# EAGLE board New_U540 (EAGLE 9.6.2), part 1 of 2
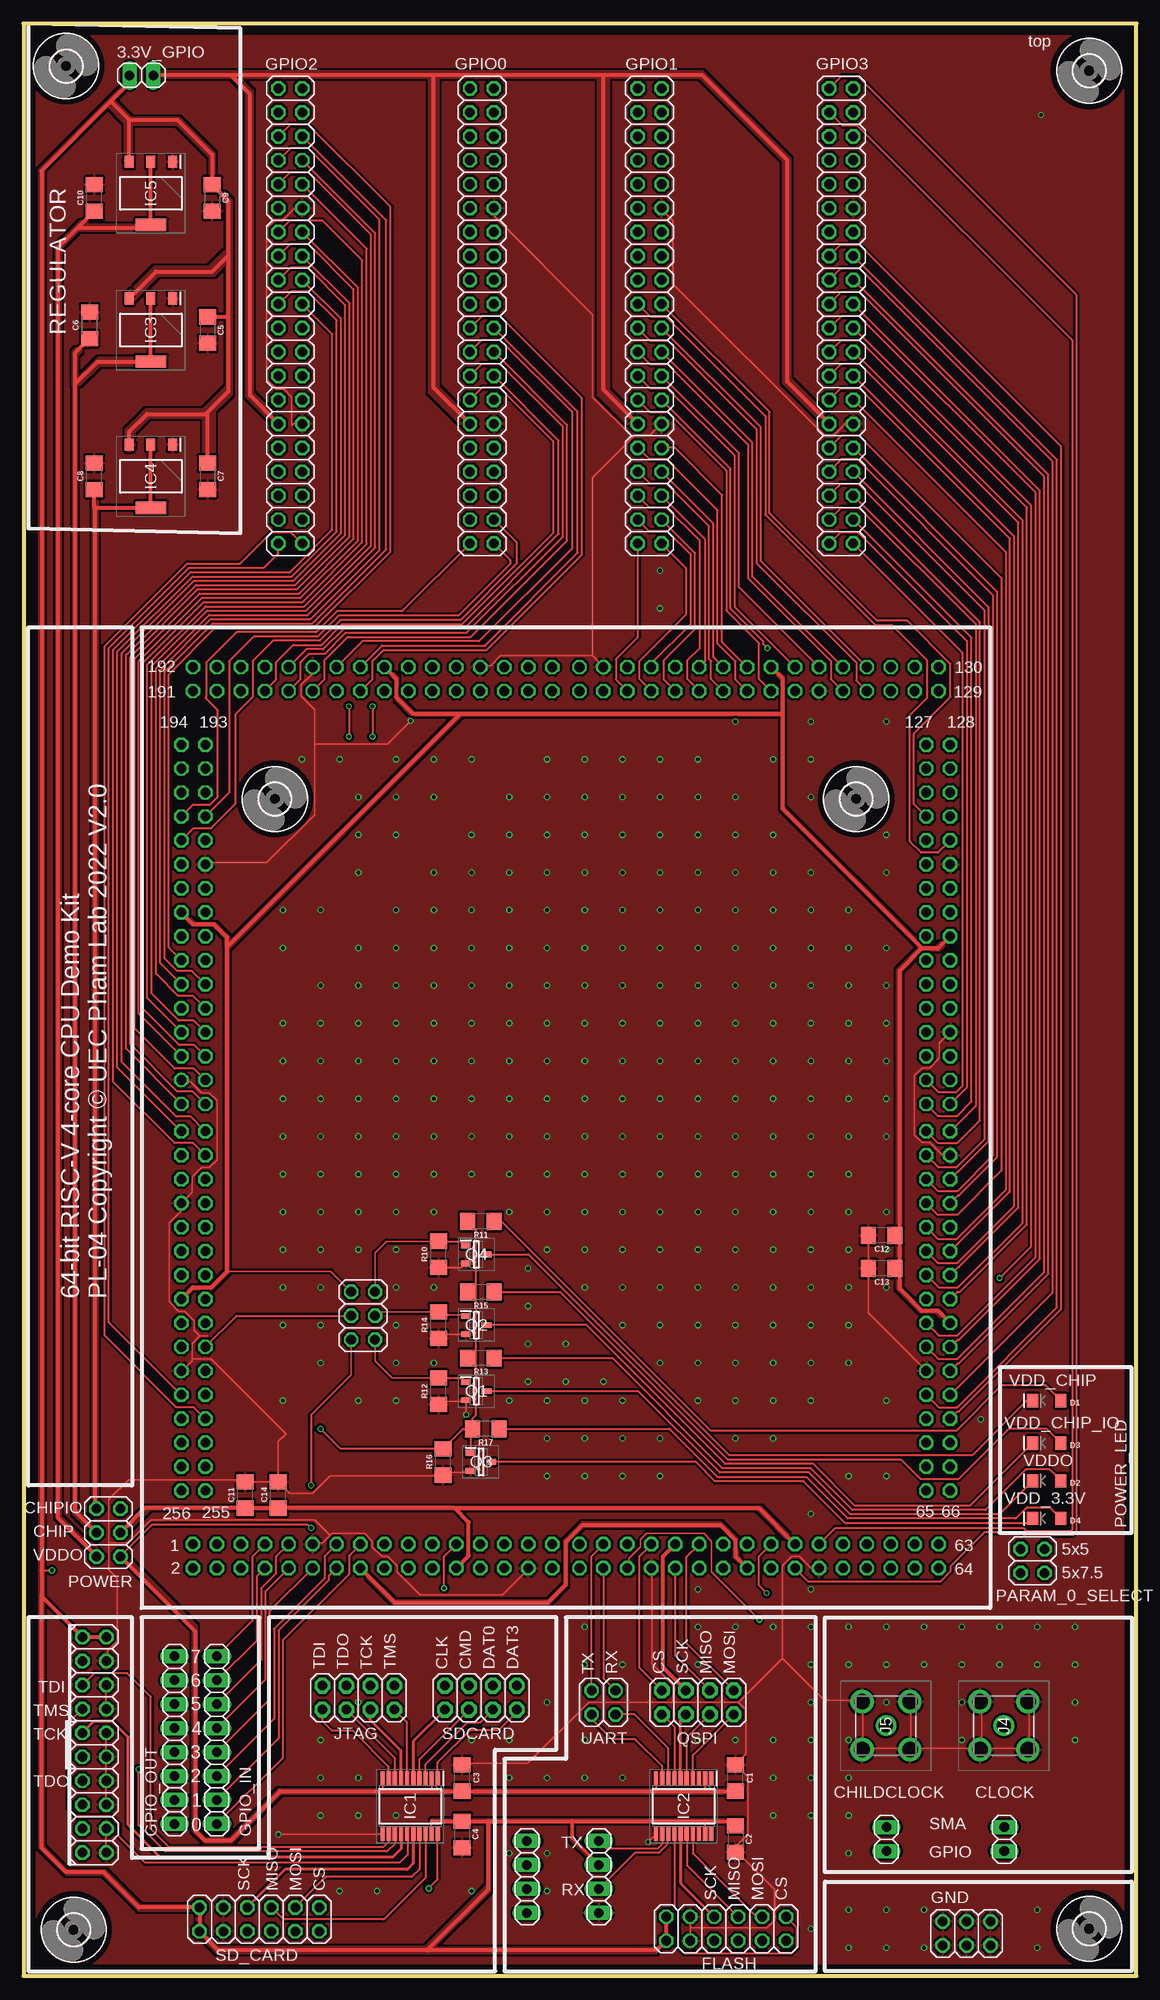
[diagram p5: board, top side]
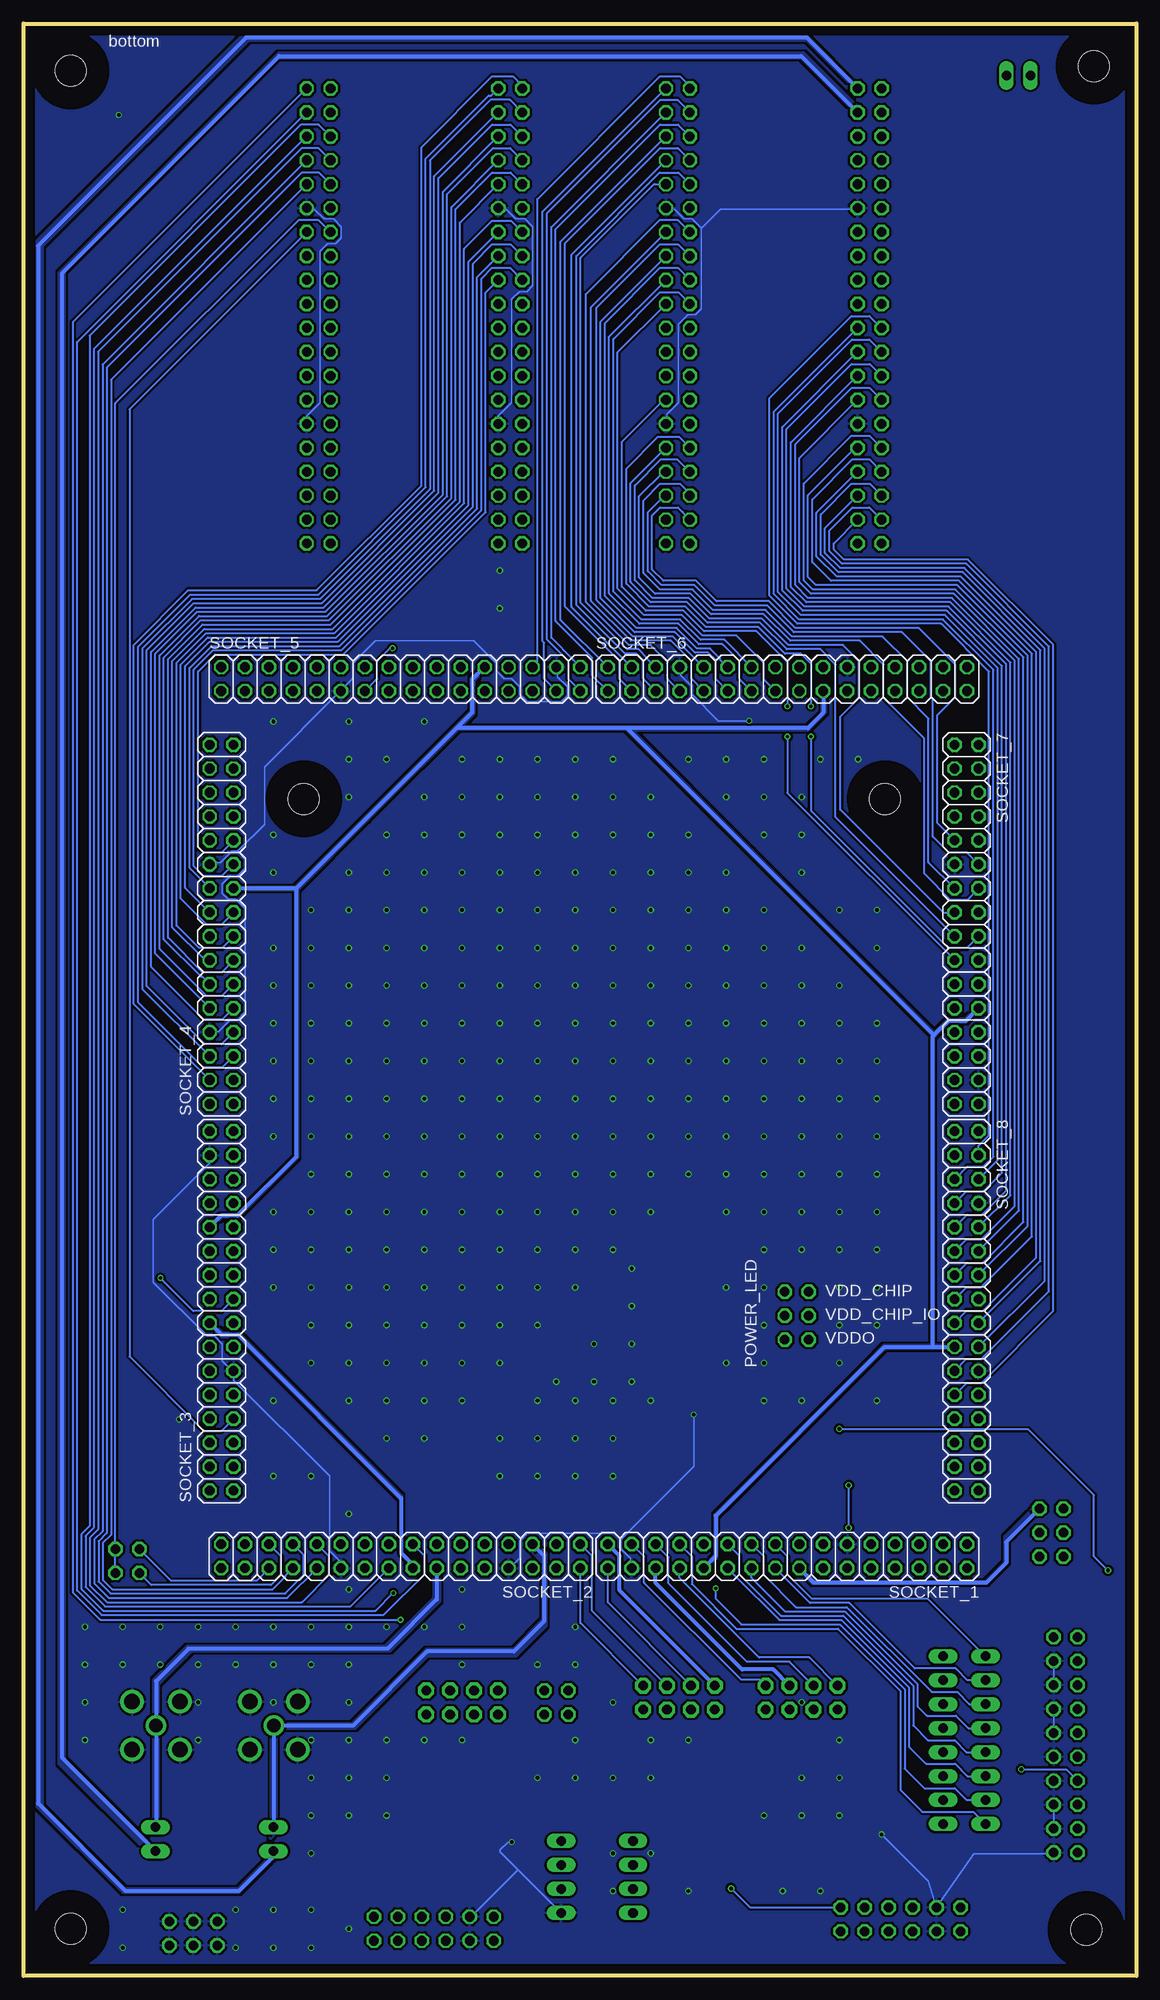
[diagram p6: board, bottom side, seen from below]

Size 118 x 207 mm. Coordinates in mm from the lower left corner, seen from the top.
Outline: 0,0 118,0 118,207 0,207 0,0
Copper layers (1*16): Top 0.035mm / dielectric 1.5mm / Bottom 0.035mm
Design rules "default *": minimum track width 6mil, minimum drill 0.35mm, track to track 10mil, track to pad 10mil, pad to pad 6mil, via to via 10mil, smd to smd 10mil, copper to edge 40mil, drill to drill 6mil, minimum pad ring 0.13mm, minimum via ring 0.13mm, stop-mask expansion 4mil, vias tented up to drill 0mil, thermal gap 10mil

## Footprints (pad centres in the part's own frame; a part is rotated, then mirrored left to right if it is on the bottom)
1X02 = drill 1.016 long: 1 -1.27,0; 2 1.27,0
1206 = smd 1.6 x 1.8: 1 -1.4,0; 2 1.4,0
LED-1206 = smd 1.2 x 1.4: A -1.5,0; C 1.5,0
2X06 = drill 1.016 octagon: 1 -6.35,-1.27; 2 -6.35,1.27; 3 -3.81,-1.27; 4 -3.81,1.27; 5 -1.27,-1.27; 6 -1.27,1.27; 7 1.27,-1.27; 8 1.27,1.27; 9 3.81,-1.27; 10 3.81,1.27; 11 6.35,-1.27; 12 6.35,1.27
2X03 = drill 1.016 octagon: 1 -2.54,-1.27; 2 -2.54,1.27; 3 0,-1.27; 4 0,1.27; 5 2.54,-1.27; 6 2.54,1.27
2X20 = drill 1.016 octagon: 1 -24.13,-1.27; 2 -24.13,1.27; 3 -21.59,-1.27; 4 -21.59,1.27; 5 -19.05,-1.27; 6 -19.05,1.27; 7 -16.51,-1.27; 8 -16.51,1.27; 9 -13.97,-1.27; 10 -13.97,1.27; 11 -11.43,-1.27; 12 -11.43,1.27; 13 -8.89,-1.27; 14 -8.89,1.27; 15 -6.35,-1.27; 16 -6.35,1.27; 17 -3.81,-1.27; 18 -3.81,1.27; 19 -1.27,-1.27; 20 -1.27,1.27; 21 1.27,-1.27; 22 1.27,1.27; 23 3.81,-1.27; 24 3.81,1.27; 25 6.35,-1.27; 26 6.35,1.27; 27 8.89,-1.27; 28 8.89,1.27; 29 11.43,-1.27; 30 11.43,1.27; 31 13.97,-1.27; 32 13.97,1.27; 33 16.51,-1.27; 34 16.51,1.27; 35 19.05,-1.27; 36 19.05,1.27; 37 21.59,-1.27; 38 21.59,1.27; 39 24.13,-1.27; 40 24.13,1.27
1X08 = drill 1.016 long: 1 -8.89,0; 2 -6.35,0; 3 -3.81,0; 4 -1.27,0; 5 1.27,0; 6 3.81,0; 7 6.35,0; 8 8.89,0
3,3 = hole 3.3: 0,0
SOP65P640X120-20N = smd 1.475 x 0.45: 1 -2.938,2.925; 2 -2.938,2.275; 3 -2.938,1.625; 4 -2.938,0.975; 5 -2.938,0.325; 6 -2.938,-0.325; 7 -2.938,-0.975; 8 -2.938,-1.625; 9 -2.938,-2.275; 10 -2.938,-2.925; 11 2.938,-2.925; 12 2.938,-2.275; 13 2.938,-1.625; 14 2.938,-0.975; 15 2.938,-0.325; 16 2.938,0.325; 17 2.938,0.975; 18 2.938,1.625; 19 2.938,2.275; 20 2.938,2.925
SOT229P700X180-4N = smd 1.3 x 0.95: 1 -3.35,2.29; 2 -3.35,0; 3 -3.35,-2.29 | smd 1.3 x 3.25: 4 3.35,0
29856004 = drill 1.64 pad 2.46: 1 0,0; 2 5.08,0; 3 5.08,5.08; 4 0,5.08 | drill 1.47 pad 2.205: 5 2.54,2.54
2X04 = drill 1.016 pad 1.676 octagon: 1 -3.81,-1.27; 2 -3.81,1.27; 3 -1.27,-1.27; 4 -1.27,1.27; 5 1.27,-1.27; 6 1.27,1.27; 7 3.81,-1.27; 8 3.81,1.27
2X10 = drill 1.016 octagon: 1 -11.43,-1.27; 2 -11.43,1.27; 3 -8.89,-1.27; 4 -8.89,1.27; 5 -6.35,-1.27; 6 -6.35,1.27; 7 -3.81,-1.27; 8 -3.81,1.27; 9 -1.27,-1.27; 10 -1.27,1.27; 11 1.27,-1.27; 12 1.27,1.27; 13 3.81,-1.27; 14 3.81,1.27; 15 6.35,-1.27; 16 6.35,1.27; 17 8.89,-1.27; 18 8.89,1.27; 19 11.43,-1.27; 20 11.43,1.27
2X02 = drill 1.016 octagon: 1 -1.27,-1.27; 2 -1.27,1.27; 3 1.27,-1.27; 4 1.27,1.27
SOT95P230X110-3N = smd 1.05 x 0.6: 1 -1.1,0.95; 2 -1.1,-0.95; 3 1.1,0
2X16 = drill 1.016 octagon: 1 -19.05,-1.27; 2 -19.05,1.27; 3 -16.51,-1.27; 4 -16.51,1.27; 5 -13.97,-1.27; 6 -13.97,1.27; 7 -11.43,-1.27; 8 -11.43,1.27; 9 -8.89,-1.27; 10 -8.89,1.27; 11 -6.35,-1.27; 12 -6.35,1.27; 13 -3.81,-1.27; 14 -3.81,1.27; 15 -1.27,-1.27; 16 -1.27,1.27; 17 1.27,-1.27; 18 1.27,1.27; 19 3.81,-1.27; 20 3.81,1.27; 21 6.35,-1.27; 22 6.35,1.27; 23 8.89,-1.27; 24 8.89,1.27; 25 11.43,-1.27; 26 11.43,1.27; 27 13.97,-1.27; 28 13.97,1.27; 29 16.51,-1.27; 30 16.51,1.27; 31 19.05,-1.27; 32 19.05,1.27
1X04 = drill 1.016 long: 1 -3.81,0; 2 -1.27,0; 3 1.27,0; 4 3.81,0

## Placement (x,y rotation side)
3.3V_GPIO  [1X02]  12.5,201.5 0 top
C1  0.1uF  [1206]  75.5,21 90 top
C2  0.1uF  [1206]  75.5,14.5 270 top
C3  0.1uF  [1206]  46.5,21 90 top
C4  0.1uF  [1206]  46.5,15 270 top
C5  100uF  [1206]  19.5,174.5 270 top
C6  22uF  [1206]  7,175 90 top
C7  100uF  [1206]  19.5,159 270 top
C8  22uF  [1206]  7.5,159 90 top
C9  100uF  [1206]  20,188.5 270 top
C10  22uF  [1206]  7.5,188.5 90 top
C11  0.1uF  [1206]  23.5,51 90 top
C12  0.1uF  [1206]  91,78.5 180 top
C13  10uF  [1206]  91,75 180 top
C14  10uF  [1206]  27,51 90 top
CHILDCLOCK  [1X02]  91.5,14.5 90 top
CLOCK  [1X02]  104,14.5 90 top
D1  [LED-1206]  108.5,61 180 top
D2  [LED-1206]  108.5,52.5 180 top
D3  [LED-1206]  108.5,56.5 180 top
D4  [LED-1206]  108.5,48.5 180 top
FLASH  PINHD-2X6  [2X06]  74.5,5 0 top
GND  PINHD-2X3  [2X03]  100,4.5 0 top
GPIO0  [2X20]  48.61,176 270 top
GPIO1  [2X20]  66.39,176 270 top
GPIO2  [2X20]  28.29,176 270 top
GPIO3  [2X20]  86.71,176 270 top
GPIO_IN  [1X08]  20.5,25 90 top
GPIO_OUT  [1X08]  16,25 90 top
H1  MOUNT-HOLE3.3  [3,3]  26.65,124.79 0 top
H4  MOUNT-HOLE3.3  [3,3]  4.5,202.5 0 top
H5  MOUNT-HOLE3.3  [3,3]  113,202 0 top
H6  MOUNT-HOLE3.3  [3,3]  113,5 0 top
H7  MOUNT-HOLE3.3  [3,3]  5.3,4.9 0 top
H8  MOUNT-HOLE3.3  [3,3]  88.29,124.79 0 top
IC1  TXB0108PWR  [SOP65P640X120-20N]  41,18 270 top
IC2  TXB0108PWR  [SOP65P640X120-20N]  70,18 270 top
IC3  AMS1117-1.8  [SOT229P700X180-4N]  13.5,174.5 270 top
IC4  AMS1117-1.8  [SOT229P700X180-4N]  13.5,159 270 top
IC5  AMS1117-1.8  [SOT229P700X180-4N]  13.5,189 270 top
J4  2985-6004  [29856004]  106.5,24 90 top
J5  2985-6004  [29856004]  94,24 90 top
JTAG  [2X04]  35.5,29.5 180 top
JTAG_20_PIN  [2X10]  7.5,24.5 270 top
PARAM_0_SELECT  PINHD-2X2  [2X02]  107,44 270 top
POWER  [2X03]  9,47 270 top
POWER_LED  [2X03]  36,70 270 top
Q1  BSH103,235  [SOT95P230X110-3N]  48,62 0 top
Q2  BSH103,235  [SOT95P230X110-3N]  48,69 0 top
Q3  BSH103,235  [SOT95P230X110-3N]  48.5,54.5 0 top
Q4  BSH103,235  [SOT95P230X110-3N]  48,76.5 0 top
QSPI  [2X04]  71.5,29 180 top
R10  10k  [1206]  44,76.5 90 top
R11  330  [1206]  48.5,80 180 top
R12  10k  [1206]  44,62 90 top
R13  330  [1206]  48.5,65.5 180 top
R14  10k  [1206]  44,69 90 top
R15  330  [1206]  48.5,72.5 180 top
R16  10k  [1206]  44.5,54.5 90 top
R17  330  [1206]  49,58 180 top
SD_CARD  PINHD-2X6  [2X06]  25,6 0 top
SDCARD  [2X04]  48.5,29.5 180 top
SOCKET_1  [2X16]  37,44.5 180 bottom
SOCKET_2  [2X16]  78,44.5 180 bottom
SOCKET_3  [2X16]  97,70.5 90 bottom
SOCKET_4  [2X16]  97,111.5 90 bottom
SOCKET_5  [2X16]  78,137.5 0 bottom
SOCKET_6  [2X16]  37,137.5 0 bottom
SOCKET_7  [2X16]  18,111.5 270 bottom
SOCKET_8  [2X16]  18,70.5 270 bottom
UART  PINHD-2X2  [2X02]  61.5,29 180 top
USB-UART_1  PINHD-1X4  [1X04]  61,10.5 90 top
USB-UART_2  PINHD-1X4  [1X04]  53.38,10.5 90 top